# EAGLE design MiniPowerAdaptorInline (EAGLE 7.5.0)
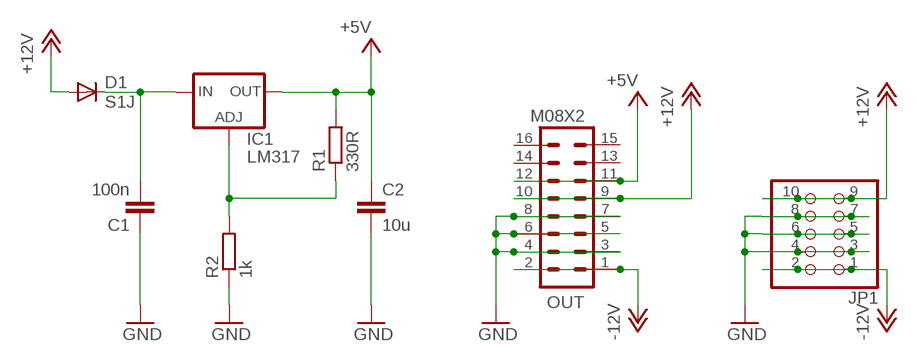
[diagram p0: schematic, sheet 1]

## Parts
C1  100n  C-EUC0603  [C0603]
C2  10u  C-EUC1206  [C1206]
D1  S1J  DIODESMA  [SMA-DIODE]
IC1  LM317  LM317MDT  [DPACK]
JP1  PINHD-2X5  [2X05]
OUT  M08X2  [2X8]
R1  330R  R-EU_0603  [0603]
R2  1k  R-EU_0603  [0603]

## Nets
+5V: C2.1 IC1.4(OUT) OUT.11 OUT.12 R1.2
+12V: D1.A JP1.9 JP1.10 OUT.9 OUT.10
-12V: JP1.1 JP1.2 OUT.1 OUT.2
GND: C1.1 C2.2 JP1.3 JP1.4 JP1.5 JP1.6 JP1.7 JP1.8 OUT.3 OUT.4 OUT.5 OUT.6 OUT.7 OUT.8 R2.1
N$1: IC1.1(ADJ) R1.1 R2.2
N$3: C1.2 D1.C IC1.3(IN)
Unconnected: OUT.13 OUT.14 OUT.15 OUT.16

## Library data of the parts
C1 C2 = rcl:C-EU: CAPACITOR, European symbol
D1 = SparkFun:DIODE: Diode These are standard reverse protection diodes and small signal diodes. SMA package can handle up to about 1A. SOD-323 can handle about 200mA. What the SOD-323 package when ordering, there are some mfgs out there that are 5-pin packages.
IC1 = v-reg:LM317?*: 500 mA Adjustable Output Positive Voltage Regulator Source: http://www.onsemi.co.jp .. LM317M-D.PDF
JP1 = pinhead:PINHD-2X5: PIN HEADER
OUT = SparkFun:M08X2
R1 R2 = Rebel:R-EU_: RESISTOR, European symbol

## Board
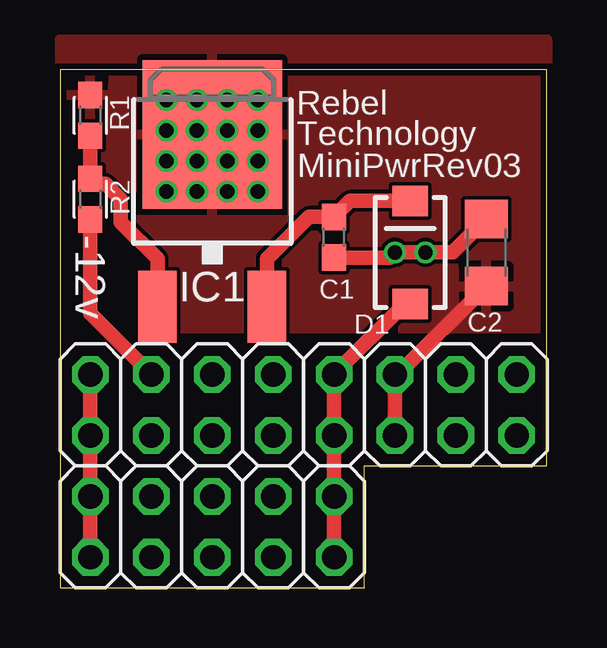
[diagram p1: board, top side]
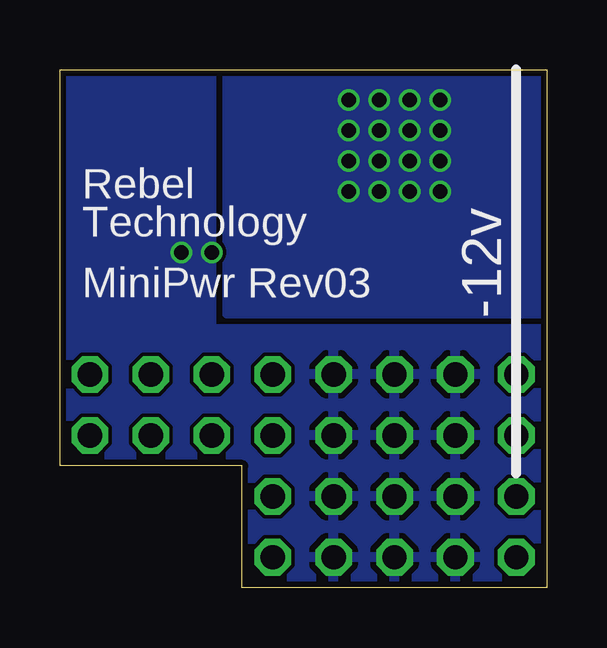
[diagram p2: board, bottom side, seen from below]

Size 20.3 x 21.59 mm. Coordinates in mm from the lower left corner, seen from the top.
Outline: 0,0 12.7,0 12.7,5.08 20.3,5.08 20.3,21.59 0,21.59 0,0
Copper layers (1*16): Top 0.035mm / dielectric 1.5mm / Bottom 0.035mm
Design rules "Fusion_eagle_rule_v1.1": minimum track width 6mil, minimum drill 12mil, track to track 6mil, track to pad 6mil, pad to pad 6mil, via to via 6mil, smd to smd 0mil, copper to edge 10mil, drill to drill 10mil, minimum pad ring 10mil, minimum via ring 6mil, stop-mask expansion 2mil, vias tented up to drill 100mil, thermal gap 10mil

### Footprints (pad centres in the part's own frame; a part is rotated, then mirrored left to right if it is on the bottom)
C0603 = smd 1.1 x 1: 1 -0.85,0; 2 0.85,0
C1206 = smd 1.6 x 1.8: 1 -1.4,0; 2 1.4,0
SMA-DIODE = smd 1.27 x 1.47: A -2.15,0; C 2.15,0
DPACK = smd 1.6 x 3: 1 -2.28,-4.8; 3 2.28,-4.8 | smd 5.8 x 6.2: 4 0,2.38
2X05 = drill 1.016 octagon: 1 -5.08,-1.27; 2 -5.08,1.27; 3 -2.54,-1.27; 4 -2.54,1.27; 5 0,-1.27; 6 0,1.27; 7 2.54,-1.27; 8 2.54,1.27; 9 5.08,-1.27; 10 5.08,1.27
2X8 = drill 1.016 octagon: 1 0,0; 2 0,2.54; 3 2.54,0; 4 2.54,2.54; 5 5.08,0; 6 5.08,2.54; 7 7.62,0; 8 7.62,2.54; 9 10.16,0; 10 10.16,2.54; 11 12.7,0; 12 12.7,2.54; 13 15.24,0; 14 15.24,2.54; 15 17.78,0; 16 17.78,2.54
0603 = smd 1.1 x 1: 1 -0.85,0; 2 0.85,0

### Placement (x,y rotation side)
C1  11.43,14.61 90 top
C2  17.78,13.97 90 top
D1  14.61,13.97 90 top
IC1  6.35,16.51 0 top
JP1  6.35,2.54 0 top
OUT  1.27,6.35 0 top
R1  1.27,19.68 90 top
R2  1.27,16.19 90 top

### Tracks (layer width: path | path; a pad name or v marks a point on that pad's centre or on a via)
+5V  (via drill 0.6)
  Top 0.406: IC1.4 6.35,17.78
  Top 0.61: OUT.11 OUT.12 14.1,8.89 C2.1 17.28,12.57
  other vias: 4.45,16.51 5.71,16.51 6.99,16.51 8.26,16.51 4.45,17.78 4.45,19.05 4.45,20.32 5.71,20.32 5.71,19.05 5.71,17.78 6.99,17.78 6.99,19.05 6.99,20.32 8.26,20.32 8.26,19.05 8.26,17.78
  pour Top: 0,22.86 20.32,22.86 20.32,10.79 0,10.79
  pour Bottom: 0,22.86 13.34,22.86 13.34,11.43 0,11.43
+12V
  Top 0.61: D1.A 14.36,11.82 OUT.10 OUT.9 JP1.10 JP1.9
-12V
  Top 0.61: OUT.2 OUT.1 JP1.2 JP1.1
GND  (via drill 0.6)
  Top 0.61: OUT.4 1.27,11.43 R2.1 | C1.1 13.76,13.76 v13.97,13.97 v15.24,13.97 16.38,13.97 C2.2
  pour Bottom: 0,10.79 0,-0.64 20.32,-0.64 20.32,10.79
  pour Bottom: 13.97,22.86 20.32,22.86 20.32,10.16 13.97,10.16
N$1
  Top 0.406: IC1.1 4.05,11.46
  Top 0.61: R1.1 R2.2 1.48,16.83 1.9,16.83 2.54,16.19 2.54,15.24 4.07,13.71 IC1.1
N$3
  Top 0.61: D1.C 12.1,16.12 C1.2 10.38,15.46 8.63,13.71 IC1.3

### Text on the board
tPlace: Rebel | R1 | Technology | MiniPwrRev03 | R2 | -12v | IC1 | C1 | D1 | C2
bPlace: Rebel | Technology | -12v | MiniPwr Rev03